# EAGLE design Fonte12V (EAGLE 9.6.2)
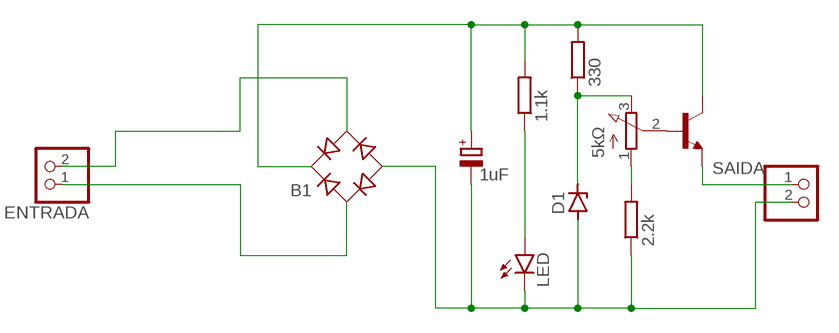
[diagram p0: schematic, sheet 1]

## Parts
B1  RB1A  [RB1A]
C1  1uF  CPOL-EUE2,5-6E  [E2,5-6E]
D1  ZENER-DIODEDO41Z10  [DO41Z10]
ENTRADA  PINHD-1X2  [1X02]
LED  TLLR4400  [LED3MM]
R1  1.1k  R-EU_0207/10  [0207/10]
R2  5kΩ  3RP/1610N  [3RP/1610N]
R3  2.2k  R-EU_0207/10  [0207/10]
R4  330  R-EU_0207/10  [0207/10]
SAIDA  PINHD-1X2  [1X02]
T1  2N706  [TO18]

## Nets
N$1: B1.+ C1.+ R1.2 R4.2 T1.3(C)
N$2: B1.- C1.- D1.A LED.K(C) R3.1 SAIDA.2
N$3: B1.AC1 ENTRADA.1
N$4: R2.2(S) T1.2(B)
N$5: R2.1(A) R3.2
N$6: SAIDA.1 T1.1(E)
N$7: D1.C R2.3(E) R4.1
N$8: B1.AC2 ENTRADA.2
N$9: LED.A R1.1

## Library data of the parts
B1 = rectifier:RB1A: RECTIFIER 1 A
C1 = rcl:CPOL-EU: POLARIZED CAPACITOR, European symbol; SPICEPREFIX: C
D1 = diode:ZENER-DIODE: Z-Diode
ENTRADA SAIDA = pinhead:PINHD-1X2: PIN HEADER
LED = led:TLLR4400: Low Current (2mA) LED 3 mm Tinted Diffused Package color RED Source: Data sheet <http://www.farnell.com/datasheets/391100.pdf>; MF: VISHAY SEMICONDUCTOR; OC_FARNELL: 1612437
R1 R3 R4 = rcl:R-EU_: RESISTOR, European symbol; SPICEPREFIX: R
R2 = pot:3RP/1610N: 16mm Potentiometer one level Source: http://www.alphapotentiometers.net/html/16mm_pot_2.html
T1 = transistor:2N706: NPN TRANSISTOR

## Board
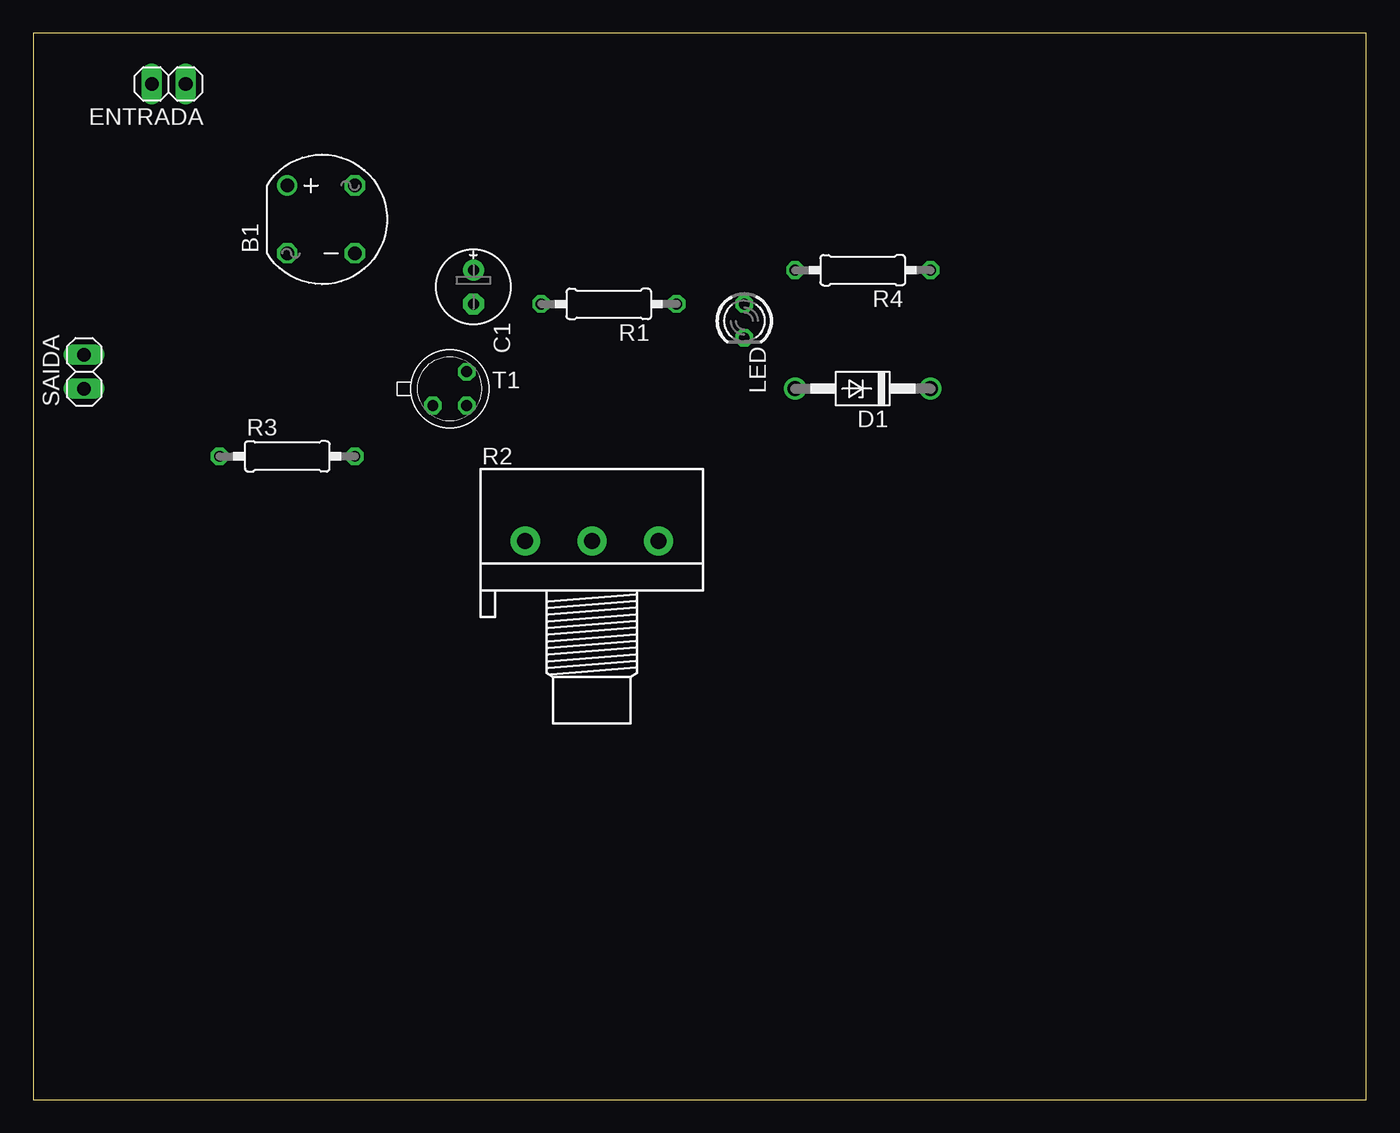
[diagram p1: board, top side]
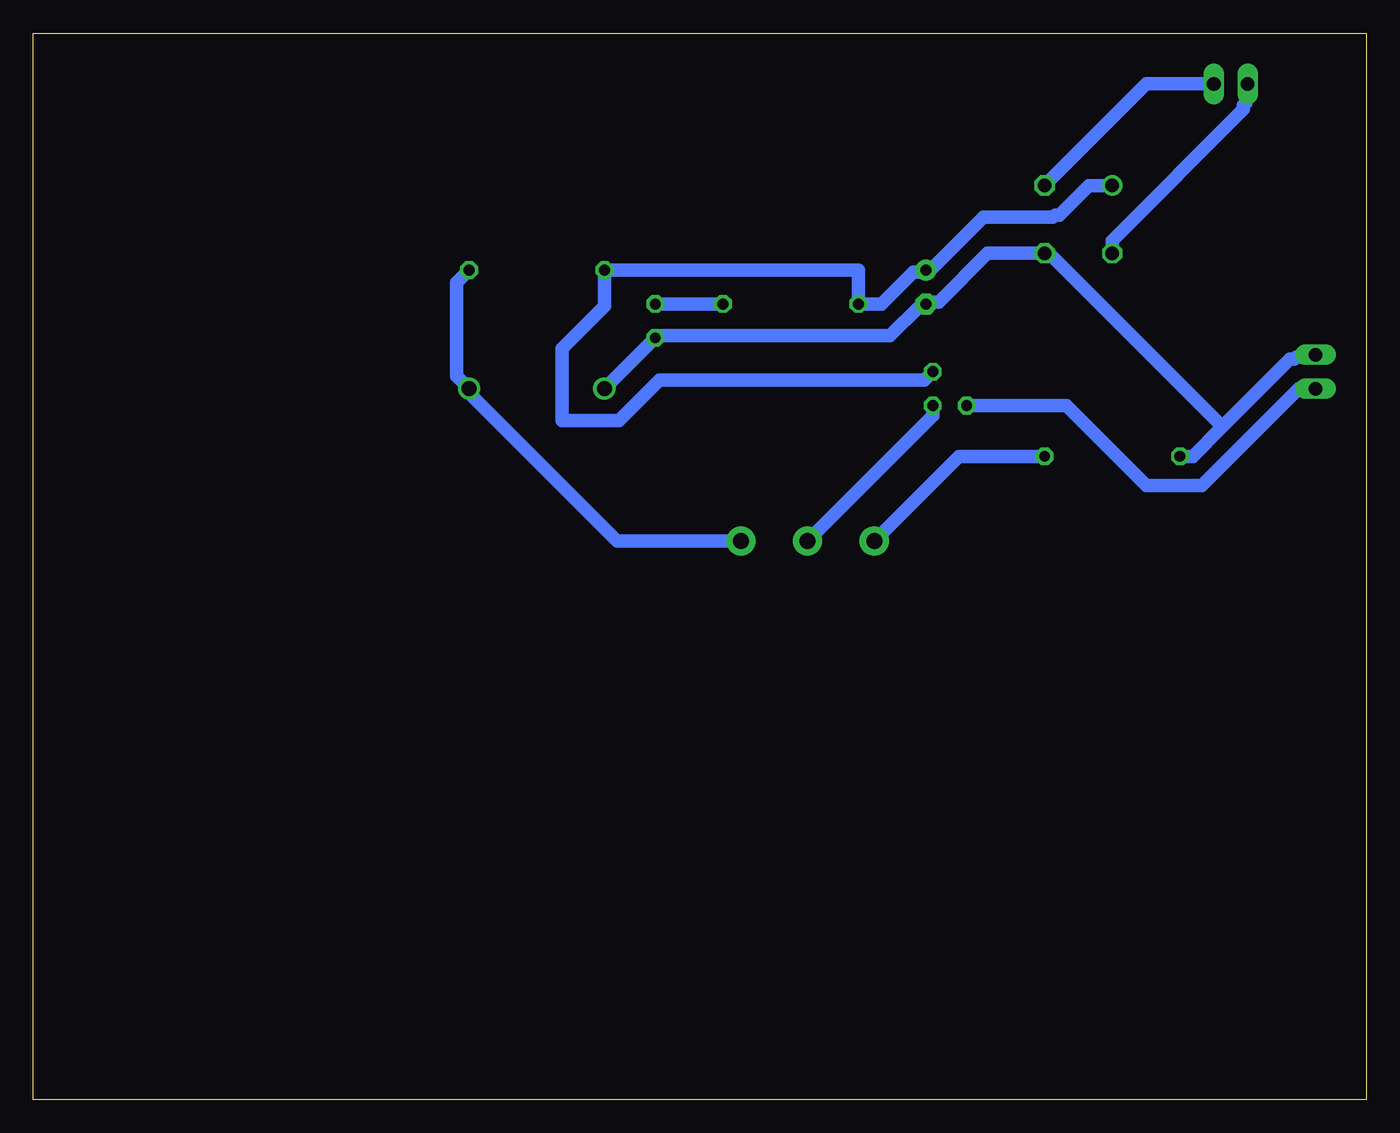
[diagram p2: board, bottom side, seen from below]

Size 100 x 80 mm. Coordinates in mm from the lower left corner, seen from the top.
Outline: 0,0 100,0 100,80 0,80 0,0
Copper layers (1*16): Top 0.035mm / dielectric 1.5mm / Bottom 0.035mm
Design rules "default *": minimum track width 40mil, minimum drill 0.35mm, track to track 40mil, track to pad 40mil, pad to pad 40mil, via to via 40mil, smd to smd 6mil, copper to edge 40mil, drill to drill 6mil, minimum pad ring 10mil, minimum via ring 8mil, stop-mask expansion 4mil, vias tented up to drill 0mil, thermal gap 10mil

### Footprints (pad centres in the part's own frame; a part is rotated, then mirrored left to right if it is on the bottom)
RB1A = drill 1.016: + -2.54,2.54 | drill 1.016 octagon: - 2.54,-2.54; AC1 2.54,2.54; AC2 -2.54,-2.54
E2,5-6E = drill 0.813 pad 1.575: + -1.27,0 | drill 0.813 pad 1.575 octagon: - 1.27,0
DO41Z10 = drill 1.118: A 5.08,0; C -5.08,0
1X02 = drill 1.016 long: 1 -1.27,0; 2 1.27,0
LED3MM = drill 0.813 octagon: A -1.27,0; K 1.27,0
0207/10 = drill 0.813 octagon: 1 -5.08,0; 2 5.08,0
3RP/1610N = drill 1.2 pad 2.184: 1 -5,0; 2 0,0; 3 5,0
TO18 = drill 0.813 octagon: 1 -1.27,-1.27; 2 1.27,-1.27; 3 1.27,1.27

### Placement (x,y rotation side)
B1  21.59,66.04 0 top
C1  33.02,60.96 270 top
D1  62.23,53.34 180 top
ENTRADA  10.16,76.2 180 top
LED  53.34,58.42 270 top
R1  43.18,59.69 180 top
R2  41.91,41.91 0 top
R3  19.05,48.26 0 top
R4  62.23,62.23 180 top
SAIDA  3.81,54.61 90 top
T1  31.24,53.34 0 top

### Tracks (layer width: path | path; a pad name or v marks a point on that pad's centre or on a via)
N$1
  Bottom 1.016: B1.+ 20.8,68.58 23.02,66.36 23.34,66.36 23.5,66.2 28.73,66.2 32.54,62.39 C1.+ 33.18,62.07 33.97,62.07 36.35,59.69 R1.2 38.1,62.23 R4.2 57.15,59.53 60.33,56.36 60.33,50.96 56.04,50.96 53.02,53.98 33.15,53.98 T1.3
N$2
  Bottom 1.016: R3.1 13.02,48.26 10.79,50.48 | 10.79,50.48 5.71,55.56 5.4,55.56 5.24,55.72 3.97,55.72 SAIDA.2 | D1.A LED.K 52.86,57.31 35.72,57.31 33.5,59.53 C1.- 32.86,59.85 32.07,59.85 28.42,63.5 B1.- 23.65,63.34 10.79,50.48
N$3
  Bottom 1.016: ENTRADA.1 16.51,76.2 B1.AC1
N$4
  Bottom 1.016: R2.2 32.51,51.31 T1.2
N$5
  Bottom 1.016: R2.1 30.56,48.26 R3.2
N$6
  Bottom 1.016: SAIDA.1 5.06,53.34 12.33,46.08 16.51,46.08 22.5,52.07 T1.1
N$7
  Bottom 1.016: R4.1 68.26,61.28 68.26,54.29 D1.C 67.15,52.86 56.2,41.91 R2.3
N$8
  Bottom 1.016: B1.AC2 19.05,64.45 9.21,74.3 9.21,74.61 9.05,74.77 9.05,76.04 ENTRADA.2
N$9
  Bottom 1.016: LED.A R1.1